# Altium project IceZUM_Core_HX1K.PrjPcb (part 2 of 2)
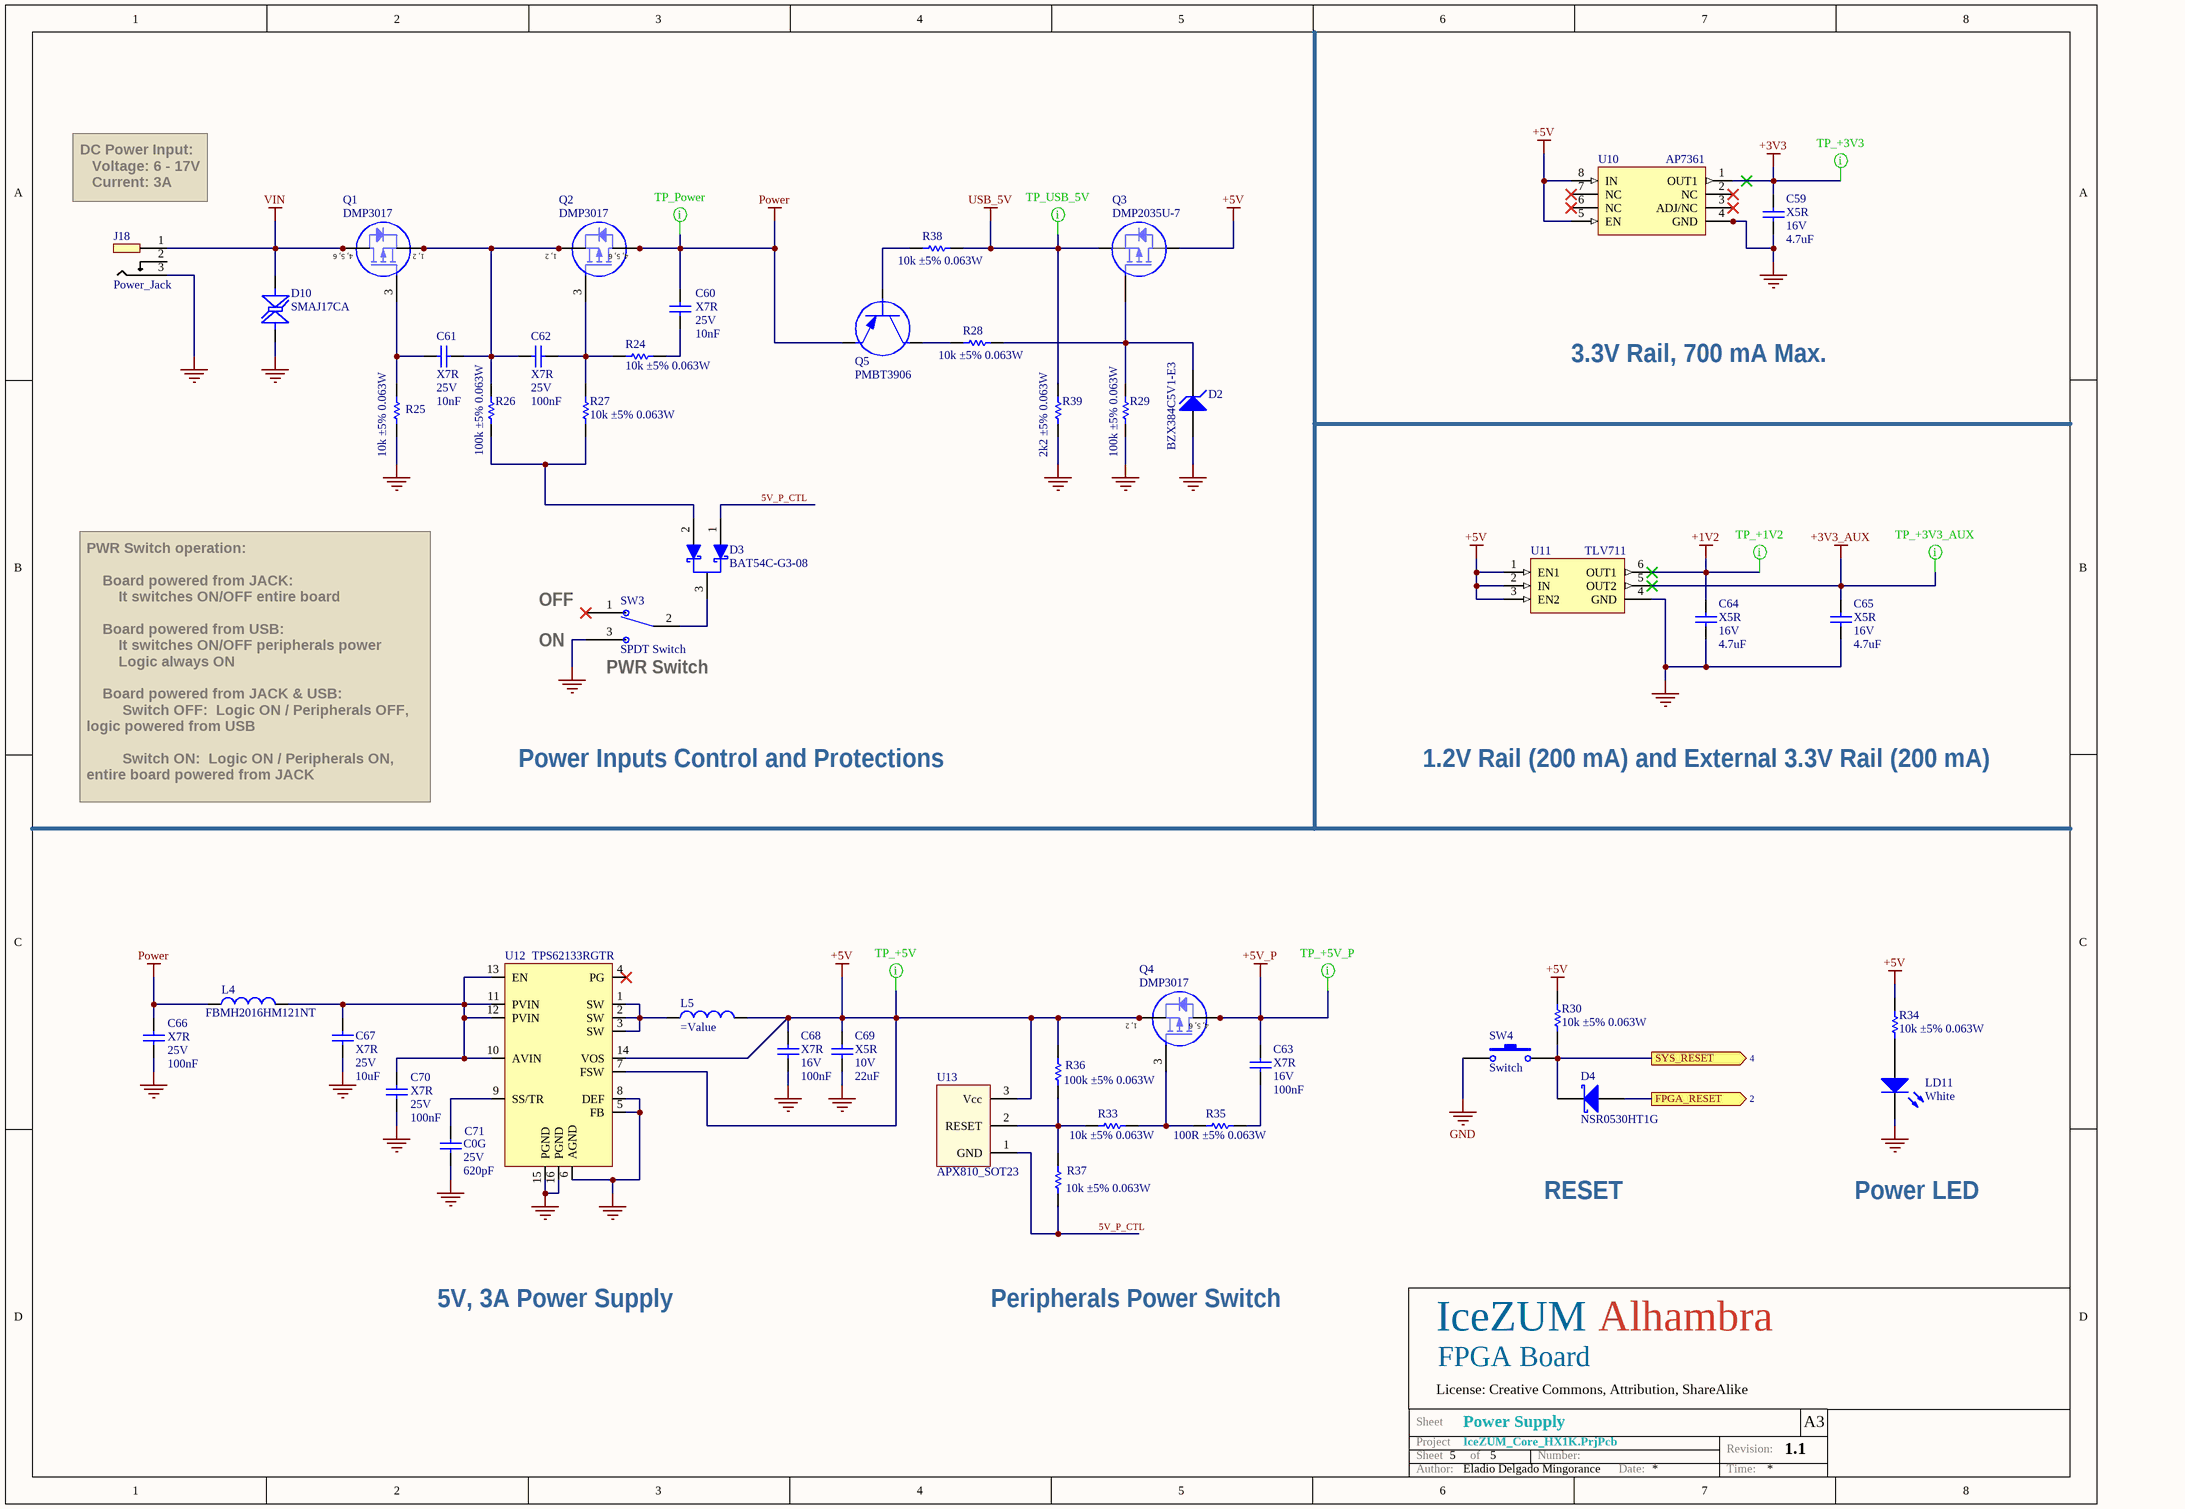
[diagram p5: [5]_Power_Supply.SchDoc]

## Nets that join several sheets
+1V2: [2]_FPGA (9 pins), [5]_Power_Supply (C64.2 U11.6)
+3V3: [2]_FPGA (28 pins), [3]_USB_Interface (24 pins), [4]_Connectors_&_IO (18 pins), [5]_Power_Supply (C59.2 U10.1)
+3V3_AUX: [4]_Connectors_&_IO (J5.4), [5]_Power_Supply (C65.2 U11.5)
+5V: [4]_Connectors_&_IO (10 pins), [5]_Power_Supply (17 pins)
+5V_P: [4]_Connectors_&_IO (25 pins), [5]_Power_Supply (C63.2 Q4.4 Q4.5 Q4.6)
GND: [2]_FPGA (25 pins), [3]_USB_Interface (39 pins), [4]_Connectors_&_IO (72 pins), [5]_Power_Supply (26 pins)
USB_5V: [3]_USB_Interface (F1.2), [5]_Power_Supply (Q3.2 R38.2 R39.2)
VIN: [4]_Connectors_&_IO (J5.8), [5]_Power_Supply (5 pins)
GPIO_L0: [2]_FPGA (R6.1 R46.2 U1.71 U2.1), [3]_USB_Interface (U3.21)
GPIO_L2: [2]_FPGA (R1.2 U1.65), [3]_USB_Interface (U3.23)
GPIO_L3: [2]_FPGA (R2.1), [3]_USB_Interface (U3.24)
NetC34_2: [2]_FPGA (U1.10), [4]_Connectors_&_IO (C34.2 R31.2 SW1.1 SW1.2)
NetC35_2: [2]_FPGA (U1.11), [4]_Connectors_&_IO (C35.2 R32.2 SW2.1 SW2.2)
NetD4_A: [2]_FPGA (R2.2 R3.2 U1.66), [5]_Power_Supply (D4.A)
NetD4_k: [4]_Connectors_&_IO (J5.3), [5]_Power_Supply (D4.k R30.1 SW4.1)
NetJ19_1: [2]_FPGA (U1.37), [4]_Connectors_&_IO (J19.1)
NetJ19_2: [2]_FPGA (U1.38), [4]_Connectors_&_IO (J19.2)
NetJ19_3: [2]_FPGA (U1.39), [4]_Connectors_&_IO (J19.3)
NetJ19_4: [2]_FPGA (U1.41), [4]_Connectors_&_IO (J19.4)
NetJ19_5: [2]_FPGA (U1.42), [4]_Connectors_&_IO (J19.5)
NetJ19_6: [2]_FPGA (U1.43), [4]_Connectors_&_IO (J19.6)
NetJ19_7: [2]_FPGA (U1.49), [4]_Connectors_&_IO (J19.7)
NetJ19_8: [2]_FPGA (U1.50), [4]_Connectors_&_IO (J19.8)
NetR16_2: [2]_FPGA (U1.21), [3]_USB_Interface (R16.2)
NetR17_1: [2]_FPGA (U1.95), [4]_Connectors_&_IO (R17.1)
NetR18_1: [2]_FPGA (U1.96), [4]_Connectors_&_IO (R18.1)
NetR20_1: [2]_FPGA (U1.91), [4]_Connectors_&_IO (R20.1 U7.3)
NetR21_1: [2]_FPGA (U1.90), [4]_Connectors_&_IO (R21.1 U7.4)
NetR40_1: [2]_FPGA (U1.97), [4]_Connectors_&_IO (R40.1)
NetR41_1: [2]_FPGA (U1.98), [4]_Connectors_&_IO (R41.1)
NetR42_1: [2]_FPGA (U1.99), [4]_Connectors_&_IO (R42.1)
NetR43_1: [2]_FPGA (U1.101), [4]_Connectors_&_IO (R43.1)
NetR44_1: [2]_FPGA (U1.102), [4]_Connectors_&_IO (R44.1)
NetR45_1: [2]_FPGA (U1.104), [4]_Connectors_&_IO (R45.1)
NetU1_1: [2]_FPGA (U1.1), [3]_USB_Interface (U3.45)
NetU1_2: [2]_FPGA (U1.2), [3]_USB_Interface (U3.44)
NetU1_3: [2]_FPGA (U1.3), [3]_USB_Interface (U3.43)
NetU1_4: [2]_FPGA (U1.4), [3]_USB_Interface (U3.41)
NetU1_7: [2]_FPGA (U1.7), [3]_USB_Interface (U3.40)
NetU1_8: [2]_FPGA (U1.8), [3]_USB_Interface (U3.39)
NetU1_9: [2]_FPGA (U1.9), [3]_USB_Interface (U3.38)
NetU1_78: [2]_FPGA (U1.78), [4]_Connectors_&_IO (U8.9)
NetU1_79: [2]_FPGA (U1.79), [4]_Connectors_&_IO (U8.8)
NetU1_80: [2]_FPGA (U1.80), [4]_Connectors_&_IO (U8.7)
NetU1_81: [2]_FPGA (U1.81), [4]_Connectors_&_IO (U8.6)
NetU1_87: [2]_FPGA (U1.87), [4]_Connectors_&_IO (U8.4)
NetU1_88: [2]_FPGA (U1.88), [4]_Connectors_&_IO (U8.5)
NetU1_93: [2]_FPGA (U1.93), [4]_Connectors_&_IO (U7.2)
NetU1_112: [2]_FPGA (U1.112), [4]_Connectors_&_IO (U9.1)
NetU1_113: [2]_FPGA (U1.113), [4]_Connectors_&_IO (U9.3)
NetU1_114: [2]_FPGA (U1.114), [4]_Connectors_&_IO (U9.4)
NetU1_115: [2]_FPGA (U1.115), [4]_Connectors_&_IO (U9.5)
NetU1_116: [2]_FPGA (U1.116), [4]_Connectors_&_IO (U9.6)
NetU1_117: [2]_FPGA (U1.117), [4]_Connectors_&_IO (U9.7)
NetU1_118: [2]_FPGA (U1.118), [4]_Connectors_&_IO (U9.8)
NetU1_119: [2]_FPGA (U1.119), [4]_Connectors_&_IO (U9.9)
NetU1_138: [2]_FPGA (U1.138), [4]_Connectors_&_IO (U6.7)
NetU1_139: [2]_FPGA (U1.139), [4]_Connectors_&_IO (U6.6)
NetU1_141: [2]_FPGA (U1.141), [4]_Connectors_&_IO (U6.5)
NetU1_142: [2]_FPGA (U1.142), [4]_Connectors_&_IO (U6.4)
NetU1_143: [2]_FPGA (U1.143), [4]_Connectors_&_IO (U6.3)
NetU1_144: [2]_FPGA (U1.144), [4]_Connectors_&_IO (U6.1)
SPI_DI: [2]_FPGA (U1.68 U2.2), [3]_USB_Interface (U3.18)
SPI_DO: [2]_FPGA (U1.67 U2.5), [3]_USB_Interface (U3.17)
SPI_SK: [2]_FPGA (R5.1 U1.70 U2.6), [3]_USB_Interface (U3.16)

## Assembly variants
Variant v1.10: not fitted C38 C39 C40 C42 C43 C44 C51 C52 C53 C54 C55 C56 C57 C58 R4 R37